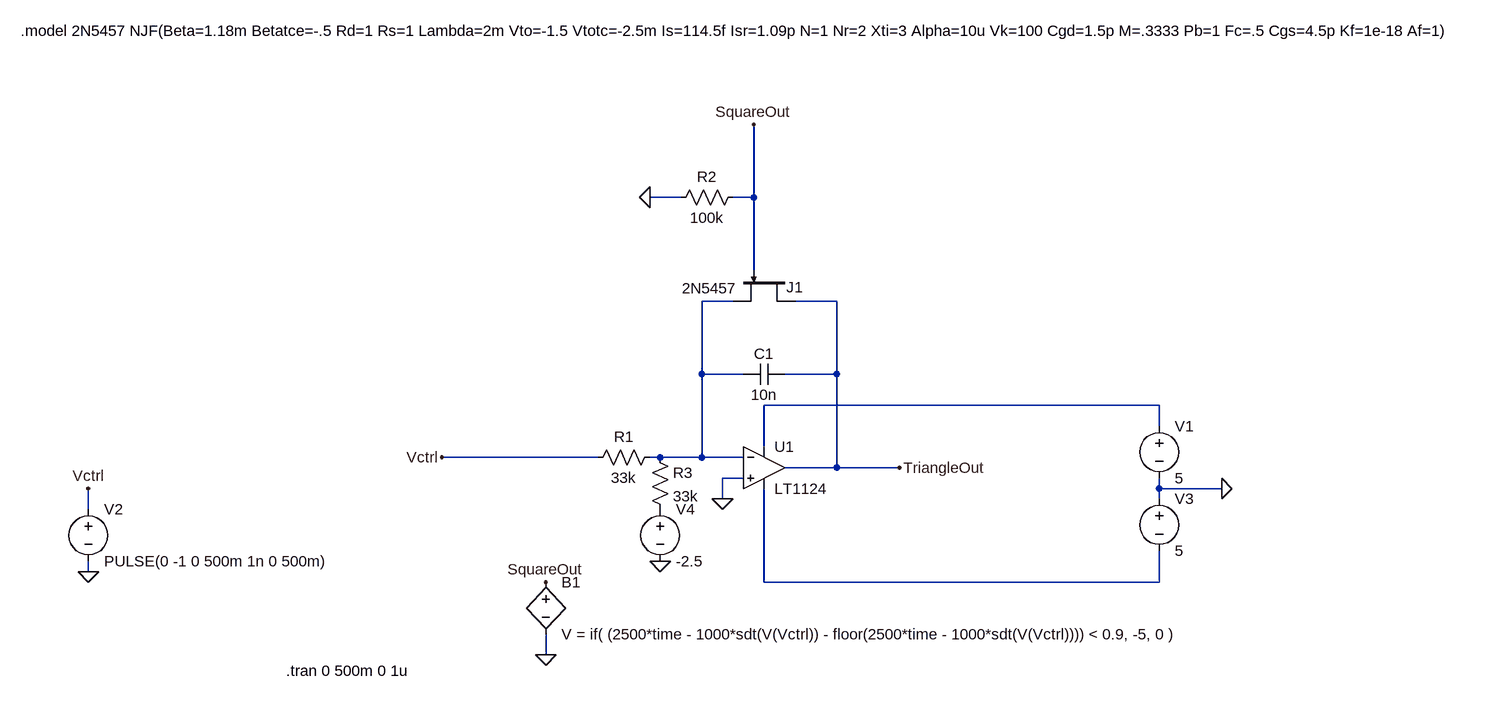
[diagram p0: schematic vco.asc]
vco.asc, the LTspice schematic file:
Version 4.1
SHEET 1 1476 820
WIRE 0 -320 -48 -320
WIRE 112 -320 112 -432
WIRE 112 -320 80 -320
WIRE 112 -208 112 -320
WIRE 80 -160 32 -160
WIRE 240 -160 176 -160
WIRE 32 -48 32 -160
WIRE 96 -48 32 -48
WIRE 240 -48 240 -160
WIRE 240 -48 160 -48
WIRE 736 0 128 0
WIRE 736 32 736 0
WIRE 128 64 128 0
WIRE -128 80 -368 80
WIRE -32 80 -48 80
WIRE 32 80 32 -48
WIRE 32 80 -32 80
WIRE 96 80 32 80
WIRE 240 96 240 -48
WIRE 240 96 160 96
WIRE 336 96 240 96
WIRE 96 112 64 112
WIRE 736 128 736 112
WIRE 832 128 736 128
WIRE 64 144 64 112
WIRE 736 144 736 128
WIRE -912 160 -912 128
WIRE -912 256 -912 240
WIRE 128 272 128 128
WIRE 736 272 736 224
WIRE 736 272 128 272
WIRE -208 384 -208 352
FLAG -912 256 0
FLAG -208 384 0
FLAG -912 128 Vctrl
FLAG 336 96 TriangleOut
FLAG -208 272 SquareOut
FLAG -368 80 Vctrl
FLAG 832 128 0
FLAG -48 -320 0
FLAG 112 -432 SquareOut
FLAG 64 144 0
FLAG -32 240 0
SYMBOL OpAmps\\LT1124 128 32 R0
SYMATTR InstName U1
SYMBOL voltage -912 144 R0
WINDOW 123 0 0 Left 0
WINDOW 39 0 0 Left 0
SYMATTR InstName V2
SYMATTR Value PULSE(0 -1 0 500m 1n 0 500m)
SYMBOL bv -208 256 R0
SYMATTR InstName B1
SYMATTR Value V = if( (2500*time - 1000*sdt(V(Vctrl)) - floor(2500*time - 1000*sdt(V(Vctrl)))) < 0.9, -5, 0 )
SYMBOL res -32 64 R90
WINDOW 0 0 56 VBottom 2
WINDOW 3 32 56 VTop 2
SYMATTR InstName R1
SYMATTR Value 33k
SYMBOL cap 160 -64 R90
WINDOW 0 0 32 VBottom 2
WINDOW 3 32 32 VTop 2
SYMATTR InstName C1
SYMATTR Value 10n
SYMBOL voltage 736 16 R0
WINDOW 123 0 0 Left 0
WINDOW 39 0 0 Left 0
SYMATTR InstName V1
SYMATTR Value 5
SYMBOL voltage 736 128 R0
WINDOW 123 0 0 Left 0
WINDOW 39 0 0 Left 0
SYMATTR InstName V3
SYMATTR Value 5
SYMBOL njf 176 -208 R90
WINDOW 0 26 -12 VRight 2
WINDOW 3 28 90 VRight 2
SYMATTR InstName J1
SYMATTR Value 2N5457
SYMBOL res 96 -336 R90
WINDOW 0 0 56 VBottom 2
WINDOW 3 32 56 VTop 2
SYMATTR InstName R2
SYMATTR Value 100k
SYMBOL res -48 64 R0
SYMATTR InstName R3
SYMATTR Value 33k
SYMBOL voltage -32 144 R0
WINDOW 123 0 0 Left 0
WINDOW 39 0 0 Left 0
SYMATTR InstName V4
SYMATTR Value -2.5
TEXT -608 408 Left 2 !.tran 0 500m 0 1u
TEXT -1016 -576 Left 2 !.model 2N5457 NJF(Beta=1.18m Betatce=-.5 Rd=1 Rs=1 Lambda=2m Vto=-1.5 Vtotc=-2.5m Is=114.5f Isr=1.09p N=1 Nr=2 Xti=3 Alpha=10u Vk=100 Cgd=1.5p M=.3333 Pb=1 Fc=.5 Cgs=4.5p Kf=1e-18 Af=1)

The netlist it stands for:
* vco.asc
X§U1 0 N001 N002 N003 TriangleOut LT1124  ; pins In+ In- V+ V- OUT
V2 Vctrl 0 PULSE(0 -1 0 500m 1n 0 500m)
B1 SquareOut 0 V = if( (2500*time - 1000*sdt(V(Vctrl)) - floor(2500*time - 1000*sdt(V(Vctrl)))) < 0.9, -5, 0 )
R1 N001 Vctrl 33k
C1 TriangleOut N001 10n
V1 N002 0 5
V3 0 N003 5
J1 TriangleOut SquareOut N001 2N5457
R2 SquareOut 0 100k
R3 N001 P001 33k
V4 P001 0 -2.5
.model NJF NJF
.model PJF PJF
.lib standard.jft
.tran 0 500m 0 1u
.model 2N5457 NJF(Beta=1.18m Betatce=-.5 Rd=1 Rs=1 Lambda=2m Vto=-1.5 Vtotc=-2.5m Is=114.5f Isr=1.09p N=1 Nr=2 Xti=3 Alpha=10u Vk=100 Cgd=1.5p M=.3333 Pb=1 Fc=.5 Cgs=4.5p Kf=1e-18 Af=1)
.lib LTC.lib
.backanno
.end